# EAGLE schematic ParasitePCB_3_1_2020 (EAGLE 9.5.2)
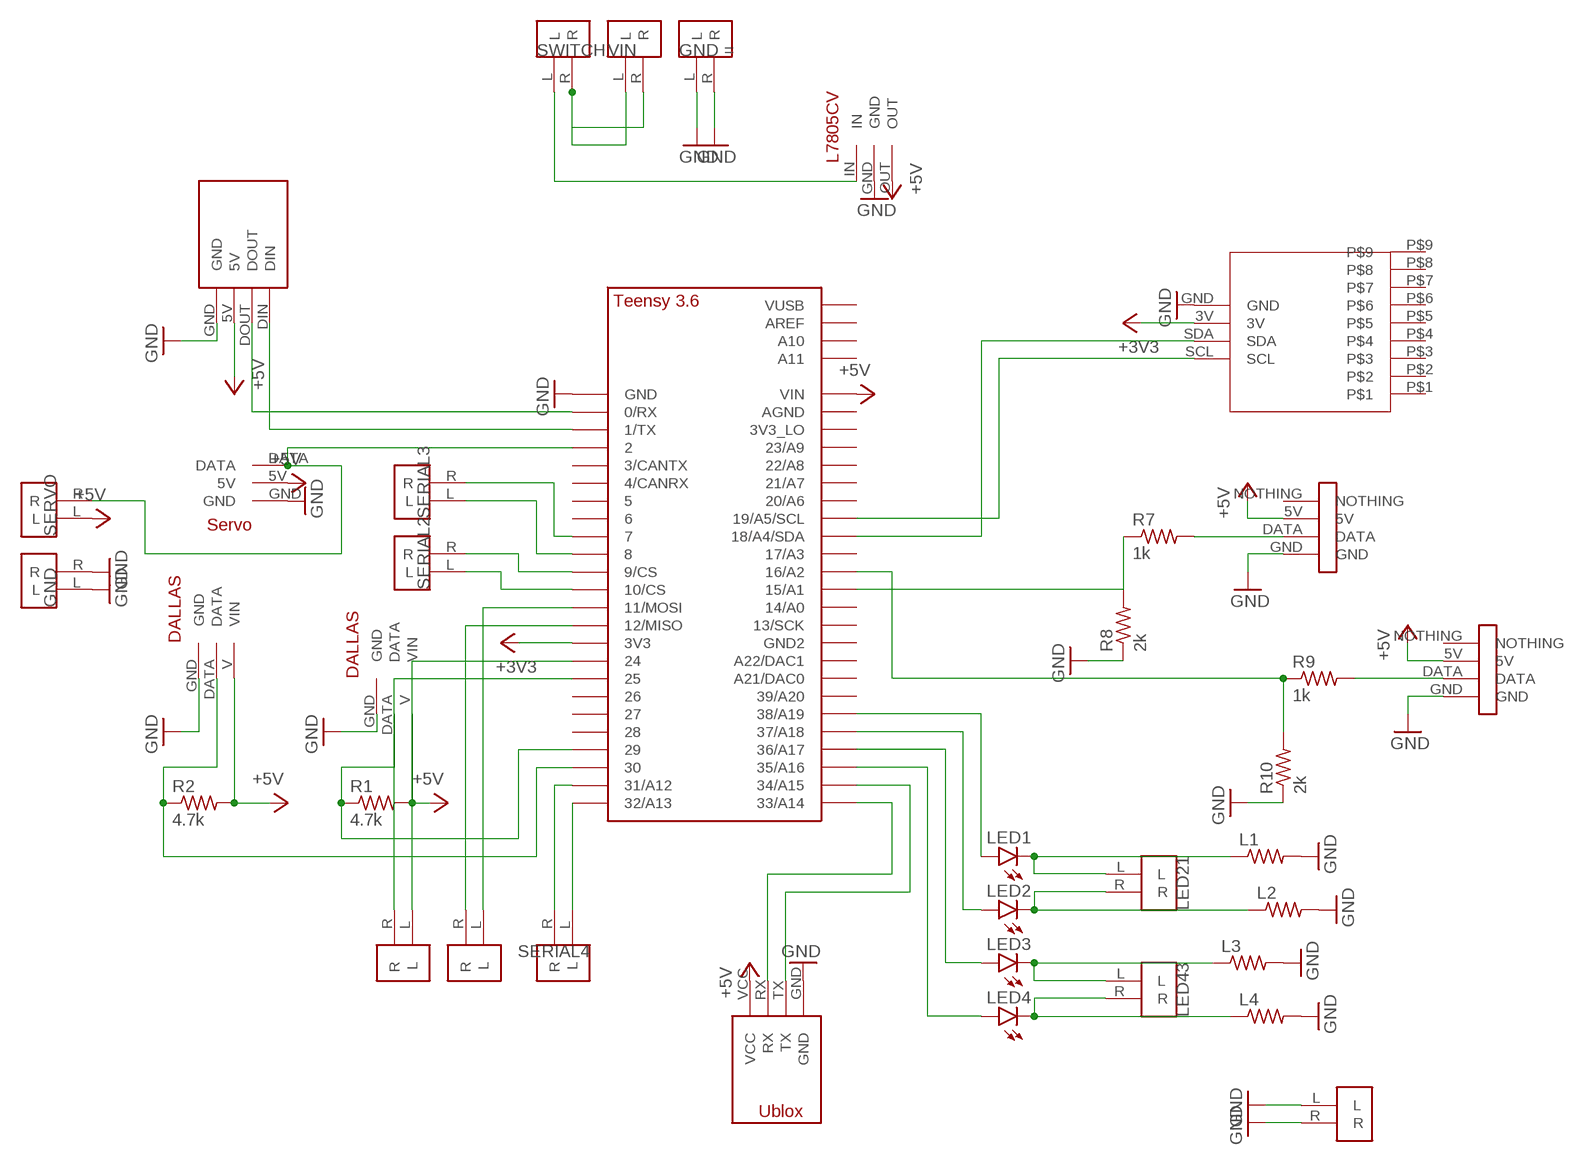
[diagram p0: schematic, sheet 1]

## Parts
HELLO  L7805CV  [L7805CV]
L1  R-US_0207/12  [0207/12]
L2  R-US_0207/12  [0207/12]
L3  R-US_0207/12  [0207/12]
L4  R-US_0207/12  [0207/12]
LED1  LED5MM  [LED5MM]
LED2  LED5MM  [LED5MM]
LED3  LED5MM  [LED5MM]
LED4  LED5MM  [LED5MM]
LED34  TERMINALBLOCK  [TERMINALBLOCK]
R1  4.7k  R-US_0207/12  [0207/12]
R2  4.7k  R-US_0207/12  [0207/12]
R7  1k  R-US_0207/12  [0207/12]
R8  2k  R-US_0207/12  [0207/12]
R9  1k  R-US_0207/12  [0207/12]
R10  2k  R-US_0207/12  [0207/12]
SERIAL4  TERMINALBLOCK  [TERMINALBLOCK]
SERVO  SERVO  [SERVO]
U$1  TEENSY_3.5/3.6_BASIC  [TEENSY_3.5/3.6_BASIC]
U$2  DALLAS  [DALLAS]
U$3  UBLOX  [UBLOX]
U$4  TERMINALBLOCK  [TERMINALBLOCK]
U$5  TERMINALBLOCK  [TERMINALBLOCK]
U$6  TERMINALBLOCK  [TERMINALBLOCK]
U$7  TERMINALBLOCK  [TERMINALBLOCK]
U$8  TERMINALBLOCK  [TERMINALBLOCK]
U$9  TERMINALBLOCK  [TERMINALBLOCK]
U$10  TERMINALBLOCK  [TERMINALBLOCK]
U$11  LSM9DS1  [LSM9DS1]
U$12  DALLAS  [DALLAS]
U$13  HONEYWELL  [HONEYWELL]
U$14  HONEYWELL  [HONEYWELL]
U$15  XBEE  [XBEE]
U$16  TERMINALBLOCK  [TERMINALBLOCK]
U$17  TERMINALBLOCK  [TERMINALBLOCK]
U$18  TERMINALBLOCK  [TERMINALBLOCK]
U$19  TERMINALBLOCK  [TERMINALBLOCK]

## Nets
+3V3: U$1.3V3 U$11.3V
+5V: HELLO.OUT R1.2 R2.2 SERVO.5V U$1.VIN U$2.V(VIN) U$3.VCC U$12.V(VIN) U$13.5V U$14.5V U$15.5V U$18.L
GND: HELLO.GND L1.2 L2.2 L3.2 L4.2 R8.1 R10.1 SERVO.GND U$1.GND U$2.GND U$3.GND U$6.L U$6.R U$8.L U$8.R U$11.GND U$12.GND U$13.GND U$14.GND U$15.GND U$19.L U$19.R
N$1: R2.1 U$1.30 U$12.DATA
N$2: U$7.R U$9.L U$9.R
N$3: R1.1 U$1.29 U$2.DATA
N$4: U$1.9/CS U$4.R
N$5: LED1.A U$1.38/A19
N$6: LED2.A U$1.37/A18
N$7: LED3.A U$1.36/A17
N$8: LED4.A U$1.35/A16
N$9: U$1.0/RX U$15.DOUT
N$10: HELLO.IN U$7.L
N$11: U$1.10/CS U$4.L
N$12: U$1.18/A4/SDA U$11.SDA
N$13: L1.1 LED1.K(C) LED34.L
N$14: L2.1 LED2.K(C) LED34.R
N$15: L3.1 LED3.K(C) U$10.L
N$16: L4.1 LED4.K(C) U$10.R
N$17: U$1.19/A5/SCL U$11.SCL
N$18: U$1.7 U$5.R
N$19: U$1.1/TX U$15.DIN
N$20: U$1.8 U$5.L
N$21: R7.2 U$13.DATA
N$22: R7.1 R8.2 U$1.15/A1
N$23: U$1.34/A15 U$3.TX
N$24: U$1.33/A14 U$3.RX
N$25: R9.2 U$14.DATA
N$26: R9.1 R10.2 U$1.16/A2
N$27: SERVO.DATA U$1.2 U$18.R
N$28: SERIAL4.R U$1.31/A12
N$29: SERIAL4.L U$1.32/A13
N$30: U$1.11/MOSI U$17.L
N$31: U$1.12/MISO U$17.R
N$32: U$1.24 U$16.L
N$33: U$1.25 U$16.R
Unconnected: U$1.3/CANTX U$1.3V3_LO U$1.4/CANRX U$1.5 U$1.6 U$1.13/SCK U$1.14/A0 U$1.17/A3 U$1.20/A6 U$1.21/A7 U$1.21/DAC0(A21/DAC0) U$1.22/A8 U$1.23/A9 U$1.26 U$1.27 U$1.28 U$1.39/A20 U$1.A10 U$1.A11 U$1.A22/DAC1 U$1.AGND U$1.AREF U$1.GND2 U$1.VUSB U$11.P$1 U$11.P$2 U$11.P$3 U$11.P$4 U$11.P$5 U$11.P$6 U$11.P$7 U$11.P$8 U$11.P$9 U$13.NOTHING U$14.NOTHING

## Library data of the parts
HELLO = L7805CV:L7805CV
L1-L4 R1 R2 R7-R10 = rcl:R-US_: RESISTOR, American symbol; SPICEPREFIX: R
LED1-LED4 = led:LED: LED OSRAM: - CHIPLED LG R971, LG N971, LY N971, LG Q971, LY Q971, LO R971, LY R971 LH N974, LH R974 LS Q976, LO Q976, LY Q976 LO Q996 - Hyper CHIPLED LW Q18S LB Q993, LB Q99A, LB R99A - SideLED LS A670, LO A670, LY A670, LG A670, LP A670 LB A673, LV A673, LT A673, LW A673 LH A674 LY A675 LS A676, LA A676, LO A676, LY A676, LW A676 LS A679, LY A679, LG A679 - Hyper Micro SIDELED® LS Y876, LA Y876, LO Y876, LY Y876 LT Y87S - SmartLED LW L88C, LW L88S LB L89C, LB L89S, LG L890 LS L89K, LO L89K, LY L89K LS L896, LA L896, LO L896, LY L896 - TOPLED LS T670, LO T670, LY T670, LG T670, LP T670 LSG T670, LSP T670, LSY T670, LOP T670, LYG T670 LG T671, LOG T671, LSG T671 LB T673, LV T673, LT T673, LW T673 LH T674 LS T676, LA T676, LO T676, LY T676, LB T676, LH T676, LSB T676, LW T676 LB T67C, LV T67C, LT T67C, LS T67K, LO T67K, LY T67K, LW E67C LS E67B, LA E67B, LO E67B, LY E67B, LB E67C, LV E67C, LT E67C LW T67C LS T679, LY T679, LG T679 LS T770, LO T770, LY T770, LG T770, LP T770 LB T773, LV T773, LT T773, LW T773 LH T774 LS E675, LA E675, LY E675, LS T675 LS T776, LA T776, LO T776, LY T776, LB T776 LHGB T686 LT T68C, LB T68C - Hyper Mini TOPLED® LB M676 - Mini TOPLED Santana® LG M470 LS M47K, LO M47K, LY M47K Source: http://www.osram.convergy.de LUXEON: - LUMILED® LXK2-PW12-R00, LXK2-PW12-S00, LXK2-PW14-U00, LXK2-PW14-V00 LXK2-PM12-R00, LXK2-PM12-S00, LXK2-PM14-U00 LXK2-PE12-Q00, LXK2-PE12-R00, LXK2-PE12-S00, LXK2-PE14-T00, LXK2-PE14-U00 LXK2-PB12-K00, LXK2-PB12-L00, LXK2-PB12-M00, LXK2-PB14-N00, LXK2-PB14-P00, LXK2-PB14-Q00 LXK2-PR12-L00, LXK2-PR12-M00, LXK2-PR14-Q00, LXK2-PR14-R00 LXK2-PD12-Q00, LXK2-PD12-R00, LXK2-PD12-S00 LXK2-PH12-R00, LXK2-PH12-S00 LXK2-PL12-P00, LXK2-PL12-Q00, LXK2-PL12-R00 Source: www.luxeon.com KINGBRIGHT: KA-3528ASYC Source: www.kingbright.com
LED34 SERIAL4 U$4-U$10 U$16-U$19 = TERMINALBLOCK:TERMINALBLOCK
SERVO = SERVO:SERVO
U$1 = Teensy356:TEENSY_3.5/3.6_BASIC
U$2 U$12 = DALLAS:DALLAS
U$3 = UBLOX:UBLOX
U$11 = LSM9DS1:LSM9DS1
U$13 U$14 = HONEYWELL:HONEYWELL
U$15 = XBEE:XBEE